# Altium schematic sheet PWR_P5V5.SchDoc: Power +5 V
size 297 x 209 mm; Author: P. Zdunek; DrawnBy: P. Zdunek; Organization: Altium Limited; Address1: L3, 12a Rodborough Rd; Address2: Frenchs Forest; Address3: NSW; Address4: Australia 2086; DocumentNumber: 27; SheetNumber: 27; SheetTotal: 37
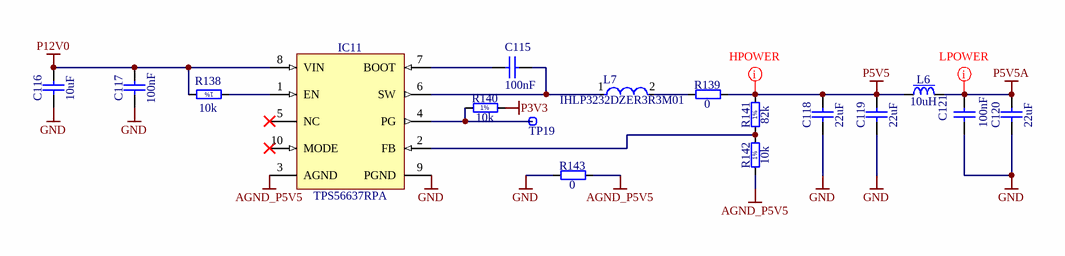
[diagram p0: PWR_P5V5.SchDoc]

## Parts
C115  100nF  [CAPC1005X55N]
C116  10uF  [CAPC1608X80N]
C117  100nF  [CAPC1005X55N]
C118  22uF  [CAPC2012X135N]
C119  22uF  [CAPC2012X135N]
C120  22uF  [CAPC2012X135N]
C121  100nF  [CAPC1005X55N]
IC11  TPS56637RPA  [TEXAS_RPA0010A]
L6  10uH  [IND_MURATA-PS_8400]
L7  IHLP3232DZER3R3M01  [FP-IHLP-3232DZ-FP_2_413x5-MFG]
R138  10k  [RESC1005X40N]
R139  0  [RESC3116X80N]
R140  10k  [RESC1005X40N]
R141  82k  [RESC1608X55N]
R142  10k  [RESC1005X40N]
R143  0  [RESC1005X40N]
TP19  Test Point  [TPS127]  (value not drawn)  (no BOM)

## Nets
AGND_P5V5: IC11.3(AGND) R142.1 R143.2
GND: C116.1 C117.1 C118.1 C119.1 C120.1 C121.1 IC11.9(PGND) R143.1
P3V3: R140.2
P5V5: C118.2 C119.2 L6.1 R139.2 R141.2
P5V5A: C120.2 C121.2 L6.2
P12V0: C116.2 C117.2 IC11.8(VIN) R138.2
NetC115_1: C115.1 IC11.6(SW) L7.1
NetC115_2: C115.2 IC11.7(BOOT)
NetIC11_1: IC11.1(EN) R138.1
NetIC11_2: IC11.2(FB) R141.1 R142.2
NetIC11_4: IC11.4(PG) R140.1 TP19.1
NetL7_2: L7.2 R139.1

Not connected (* = marked no-connect by the designer): IC11 5(NC)* 10(MODE)*

## Layout directives
net class Lpower; rule Routing Via Style [Pref Size = 0.6mm    Pref Hole Size = 0.3mm]; rule Width Constraint [Pref Width = 15mil    Min Width = 10mil    Max Width = 20mil]: P5V5, P5V5A

## Notes on the sheet
- Project
- Document
- Designer
- Drawn by
- Check.by
- File
- Last Mod.
- Print Date
- Sheet
- Size
- A4
- of
- Rev
- (in symbol R0402_10K_1%_0.0625W_100PPM) 1%
- (in symbol R0603_82K_1%_0.1W_100PPM) 1%

## Library data of the parts
C115 C117 C121 = CC0402_100NF_16V_10%_X5R: Non-polarised capacitor; Part Description: SMD Multilayer Chip Ceramic Capacitor; Manufacturer: GENERIC; Manufacturer1 Part Number: GRM155R61C104KA88D; Voltage: 16V; TC: X5R; Tolerance: ±10%; Part Number: CC0402_100NF_16V_10%_X5R; Component Kind: Standard; Component Type: Standard; Pin Count: 2; Value: 100nF; Status: None; Manufacturer Part Number: CC0402_100NF_16V_10%_X5R; Case: 0402; Mounted: Yes; Socket: No; SMD: Yes; Sense: No; Manufacturer1 Example: MURATA; Manufacturer1 ComponentHeight: 0.55mm; HelpURL: \\cern.ch\dfs\Applications\Altium\Datasheets\CC0402_X5R_MURATA_GRM.pdf; Author: CERN DEM JLC; CreateDate: 10.12.2013; LatestRevisionDate: 10.12.2013
C116 = CC0603_10UF_10V_10%_X5R: Non-polarised capacitor; Part Description: SMD Multilayer Chip Ceramic Capacitor; Manufacturer: GENERIC; Manufacturer1 Part Number: GRM188R61A106KE69D; Voltage: 10V; TC: X5R; Tolerance: ±10%; Part Number: CC0603_10UF_10V_10%_X5R; Component Kind: Standard; Component Type: Standard; Pin Count: 2; Value: 10uF; Status: None; Manufacturer Part Number: CC0603_10UF_10V_10%_X5R; Case: 0603; Mounted: Yes; Socket: No; SMD: Yes; Sense: No; Manufacturer1 Example: MURATA; Manufacturer1 ComponentHeight: 0.8mm; HelpURL: \\cern.ch\dfs\Applications\Altium\Datasheets\CC0603_MURATA_GRM188R61A106KE69D.pdf; Author: CERN DEM JLC; CreateDate: 31/01/2017; LatestRevisionDate: 31/01/2017
C118-C120 = CC0805_22UF_16V_10%_X5R: Non-polarised capacitor; Part Description: SMD Multilayer Chip Ceramic Capacitor; Manufacturer: GENERIC; Manufacturer1 Part Number: C2012X5R1C226KT; Voltage: 16V; TC: X5R; Tolerance: ±10%; Part Number: CC0805_22UF_16V_10%_X5R; Component Kind: Standard; Component Type: Standard; Pin Count: 2; Value: 22uF; Status: Preferred; Manufacturer Part Number: CC0805_22UF_16V_10%_X5R; Case: 0805; Mounted: Yes; Socket: No; SMD: Yes; Sense: No; Manufacturer1 Example: TDK; Manufacturer1 ComponentHeight: 1.35mm; HelpURL: \\cern.ch\dfs\Applications\Altium\Datasheets\CC0805_X5R_TDK_C.pdf; Author: CERN DEM JLC
  C118 C119: CreateDate: 25-Oct-12; LatestRevisionDate: 25-Oct-12
  C120: CreateDate: 25.10.2012; LatestRevisionDate: 25.10.2012
IC11 = TPS56637RPA: 4.5V to 28V Input, 6A Synchronous Buck Converter; Manufacturer: TEXAS INSTRUMENTS; PressFit: No; Bonding: No; Part Number: TPS56637RPA; Component Kind: Standard; Component Type: Standard; Device: TPS56637RPA; PackageDescription: TEXAS Case Style RPA0010A, QFN, 0.50mm Pitch; 10 Pin, 3.00mm W X3.00mm L X 1.00mm H body; Part Description: 4.5V to 28V Input, 6A Synchronous Buck Converter; Manufacturer Part Number: TPS56637RPA; Pin Count: 10; Mounted: Yes; Socket: No; SMD: Yes; Sense: No; ComponentHeight: 1mm; HelpURL: \\cern.ch\dfs\Applications\Altium\Datasheets\TPS56637RPA.pdf; Author: CERN DEM BC; CreateDate: 06/07/2020; LatestRevisionDate: 06/07/2020
L6 = IND_10UH_10%_MURATA-PS_8400: Inductor With Core; Part Description: Miniature Surface Mount Power Inductor (8400 Serie); Manufacturer: MURATA POWER SOLUTIONS; Manufacturer Part Number: 84103C; Power: 950mA; Resistance: 0.24R; Tolerance: ±10%; Part Number: IND_10UH_10%_MURATA-PS_8400; Component Kind: Standard; Component Type: Standard; Pin Count: 2; Value: 10uH; Status: None; Mounted: Yes; Socket: No; SMD: Yes; Sense: No; ComponentHeight: 2.9mm; HelpURL: \\cern.ch\dfs\Applications\Altium\Datasheets\IND_MURATA-PS_8400.pdf; Author: CERN DEM JLC; CreateDate: 02.07.2012; LatestRevisionDate: 02.07.2012
L7 = CMP-02424-000021-1: Commercial Inductors, Low DCR Series 3.3uH 9.2 A 17.7mΩ 20%; Self Resonant Frequency: 17MHz; Test Frequency: 100kHz; Current Rating: 8A; Core Material: Ferrite; Saturation Current: 8.7A; DC Resistance (DCR): 22.6mR; Inductance: 4.7uH; Shielding: Shielded; Packaging: Tape and Reel; RMS Current (Irms): 8A; Min Operating Temperature: -55°C; Tolerance: 20%; Contact Plating: Tin; Width: 8.18mm; Number of Pins: 2; Inductance Tolerance: 20%; Height: 4mm; Mount: Surface Mount; Package Quantity: 500; Lead Free: Lead Free; Max DC Current: 8A; Case/Package: 3232; Military Standard: Not; Max Operating Temperature: 125°C; Depth: 8.26mm; Length: 8.89mm; Termination: SMD/SMT; Height - Seated (Max): 0.157inch; Radiation Hardening: No
R138 R140 R142 = R0402_10K_1%_0.0625W_100PPM: Resistor - 1%; Part Description: General Purpose Thick Film Chip Resistor; Manufacturer: GENERIC; Manufacturer1 Part Number: 232270671003L; PressFit: No; TC: ±100ppm/°C; Part Number: R0402_10K_1%_0.0625W_100PPM; Component Kind: Standard; Component Type: Standard; Pin Count: 2; Value: 10k; Status: Not Recommended; Manufacturer Part Number: R0402_10K_1%_0.0625W_100PPM; Case: 0402; Mounted: Yes; Sense: No; Socket: No; SMD: Yes; Manufacturer1 Example: YAGEO PHYCOMP; Manufacturer1 ComponentHeight: 0.4mm; HelpURL: \\cern.ch\dfs\Applications\Altium\Datasheets\R0402_Phycomp_RC0402.pdf; Author: CERN DEM JLC; Power: 0.0625W; Tolerance: ±1%
  R138 R140: CreateDate: 03-Dec-07; LatestRevisionDate: 17-Oct-12
  R142: CreateDate: 03/12/2007; LatestRevisionDate: 17/10/2012
R139 = R1206_0R_JUMPER_SEI_HCJ: Resistor; Part Description: 38.7A (0.0005R Max DC Resistance) Zero Ohm Jumper; Manufacturer: SEI (STACKPOLE ELECTRONICS INC.); Manufacturer Part Number: HCJ1206ZT0R00; PressFit: No; Part Number: R1206_0R_JUMPER_SEI_HCJ; Component Kind: Standard; Component Type: Standard; Pin Count: 2; Value: 0; Status: Not Recommended; Case: 1206; Mounted: Yes; Sense: No; Socket: No; SMD: Yes; HelpURL: \\cern.ch\dfs\Applications\Altium\Datasheets\R1206_SEI_HCJ.pdf; Author: CERN DEM MR; CreateDate: 20/02/2018; LatestRevisionDate: 20/02/2018; ComponentHeight: 0.8mm
R141 = R0603_82K_1%_0.1W_100PPM: Resistor - 1%; Part Description: General Purpose Thick Film Chip Resistor; Manufacturer: GENERIC; Manufacturer1 Part Number: NRC06F8202TRF; PressFit: No; Power: 0.1W; TC: ±100ppm/°C; Part Number: R0603_82K_1%_0.1W_100PPM; Component Kind: Standard; Component Type: Standard; Pin Count: 2; Value: 82k; Status: Preferred; Manufacturer Part Number: R0603_82K_1%_0.1W_100PPM; Case: 0603; Mounted: Yes; Sense: No; Socket: No; SMD: Yes; Manufacturer1 Example: NIC COMPONENT; Manufacturer1 ComponentHeight: 0.55mm; HelpURL: \\cern.ch\dfs\Applications\Altium\Datasheets\R0603_NIC_NRC.pdf; Author: CERN DEM JLC; CreateDate: 03/12/2007; LatestRevisionDate: 13/03/2008; Tolerance: ±1%
R143 = R0402_0R_JUMPER: Resistor; Part Description: 1A (0.05R Max DC Resistance) Zero Ohm Jumper; Manufacturer: GENERIC; Manufacturer1 Part Number: 232270591001L; PressFit: No; Part Number: R0402_0R_JUMPER; Component Kind: Standard; Component Type: Standard; Pin Count: 2; Value: 0; Status: Not Recommended; Manufacturer Part Number: R0402_0R_JUMPER; Case: 0402; Mounted: Yes; Sense: No; Socket: No; SMD: Yes; Manufacturer1 Example: YAGEO PHYCOMP; Manufacturer1 ComponentHeight: 0.4mm; HelpURL: \\cern.ch\dfs\Applications\Altium\Datasheets\R0402_Phycomp_RC0402.pdf; Author: CERN DEM JLC; CreateDate: 03/12/2007; LatestRevisionDate: 17/10/2012
TP19 = SMD_PAD_1.27X1.27MM: Part Description: 1.27mm x 1.27mm PCB Copper Area (SMD Test Point); Mounted: No; Part Number: SMD_PAD_1.27X1.27MM; Component Type: Standard (No BOM); Pin Count: 1; Family: Test Point; Socket: No; SMD: Yes; Sense: No; Status: None; ComponentHeight: 0mm; HelpURL: Undefined; Author: CERN DEM JLC; CreateDate: 12.01.2008; LatestRevisionDate: 12.01.2008; PackageDescription: 1.27mm x 1.27mm PCB Copper Area (SMD Test Point)